# EAGLE board smarty07 (EAGLE 6.5.0)
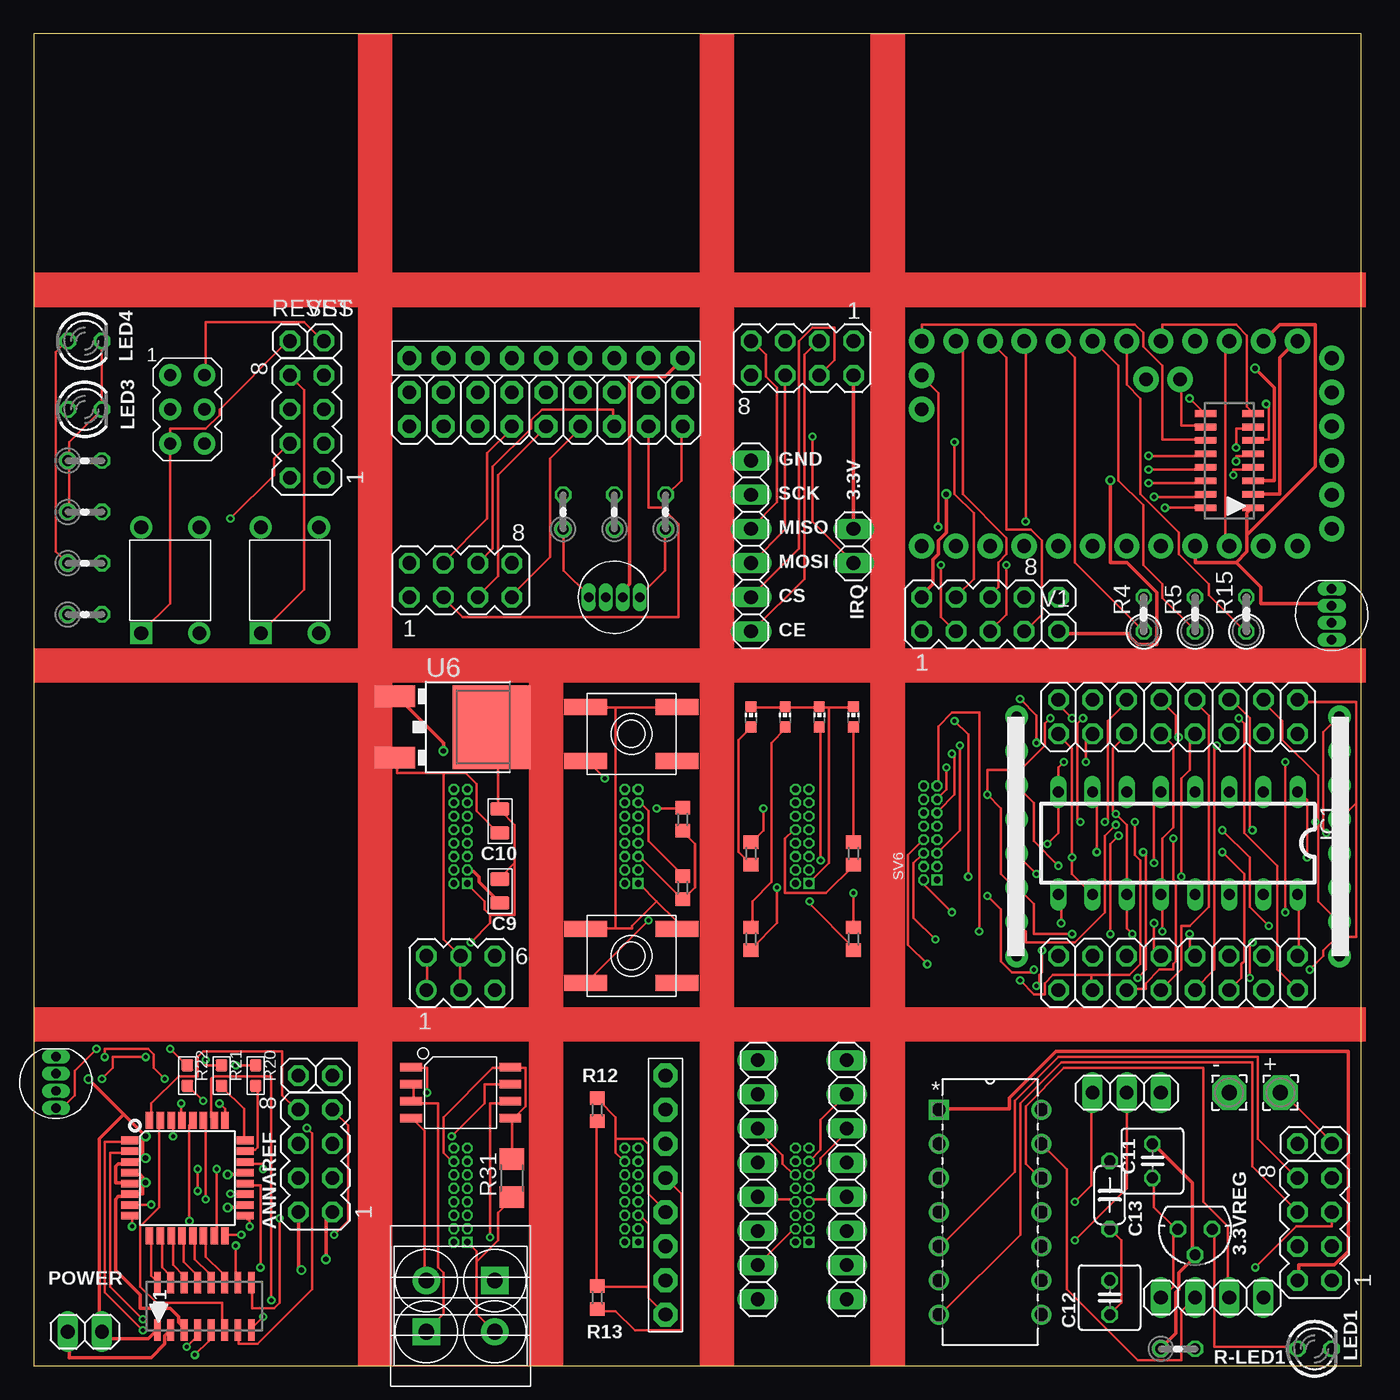
[diagram p2: board, top side]
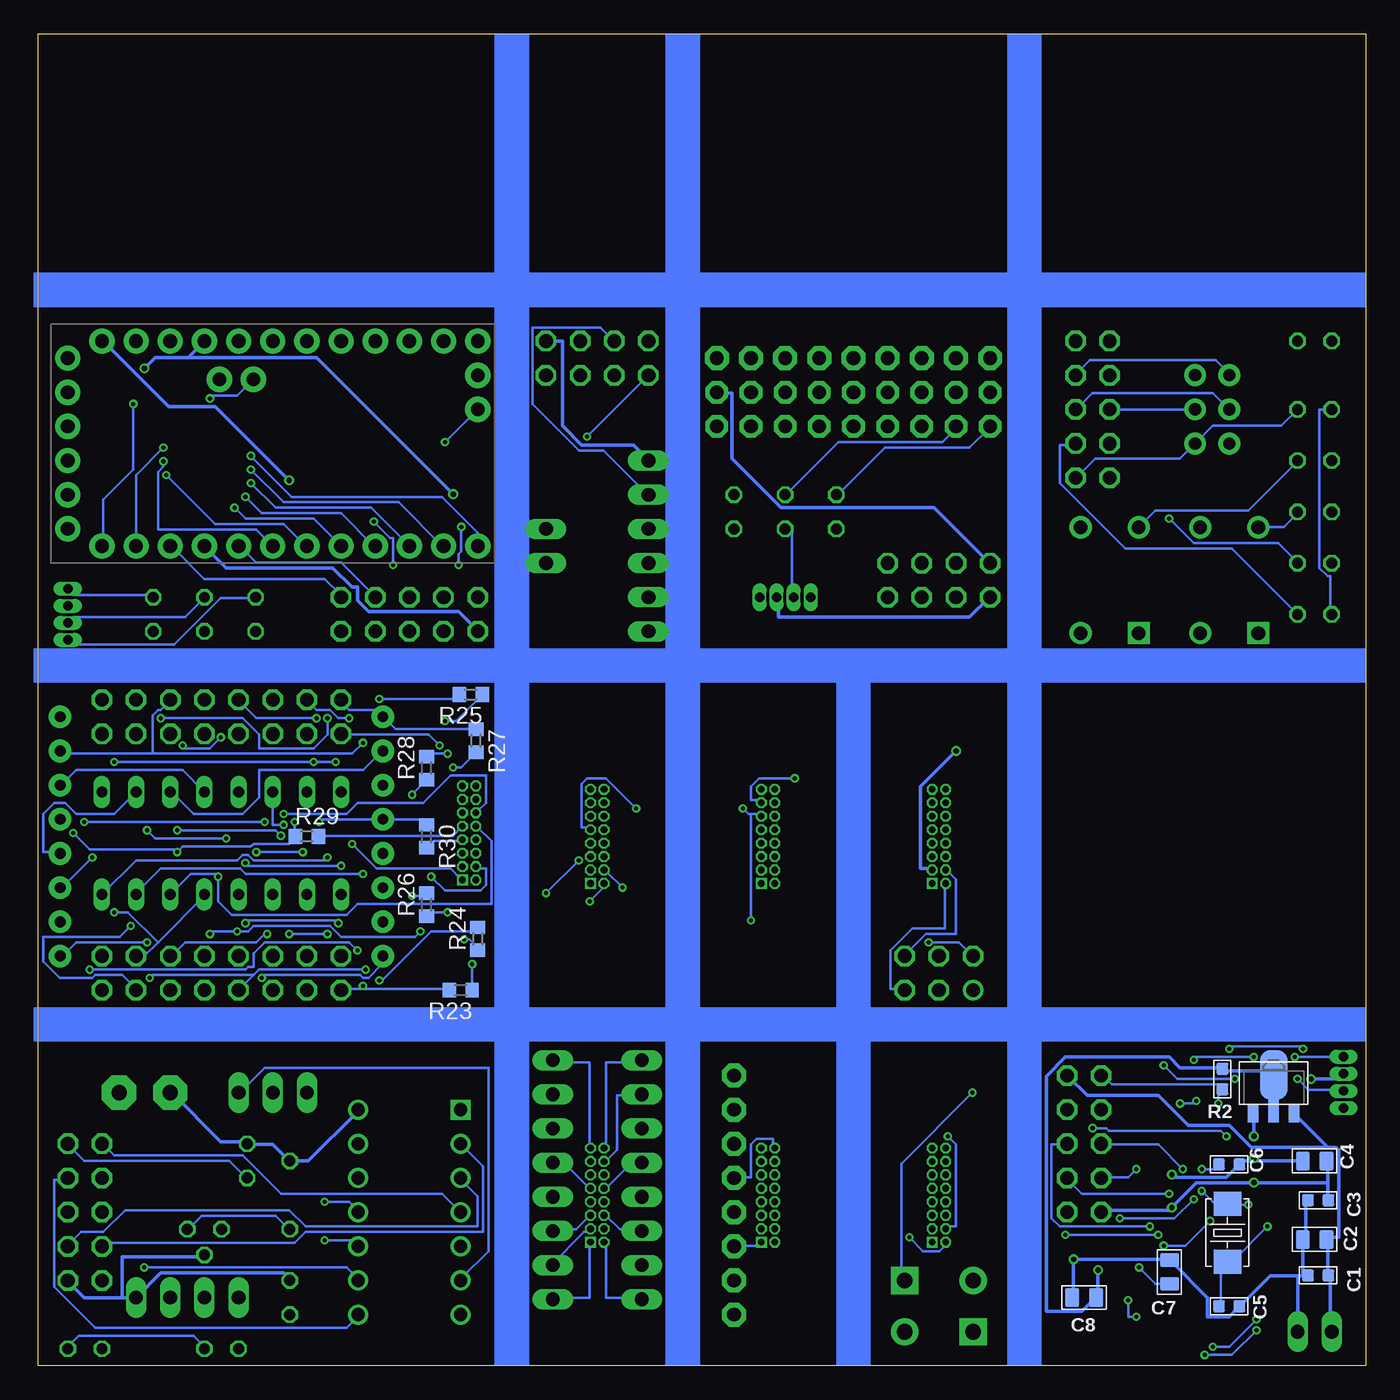
[diagram p3: board, bottom side, seen from below]

Size 98.73 x 99.05 mm. Coordinates in mm from the lower left corner, seen from the top.
Outline: 0,0 98.73,0 98.73,99.05 0,99.05 0,0
Copper layers (1*2*15*16): Top 0.035mm / dielectric 0.2mm / layer 2 0.0175mm / dielectric 1.1mm / layer 15 0.0175mm / dielectric 0.2mm / Bottom 0.035mm
Design rules "SeeedStudio_DRU_no_angle_20130527": minimum track width 6mil, minimum drill 12mil, track to track 6mil, track to pad 6mil, pad to pad 6mil, via to via 6mil, smd to smd 0mil, copper to edge 10mil, drill to drill 10mil, minimum pad ring 6mil, minimum via ring 6mil, stop-mask expansion 2mil, vias tented up to drill 25mil, thermal gap 10mil
Net classes: 0 default: width 0.203 mm, drill 0.203 mm, clearance 0.152 mm; 1 power: width 0.254 mm, drill 0.406 mm, clearance 0.152 mm; 2 thnet: width 0.203 mm, drill 0.203 mm, clearance 0.305 mm

## Footprints (pad centres in the part's own frame; a part is rotated, then mirrored left to right if it is on the bottom)
78LXX = drill 0.813 octagon: GND 0,1.905; IN 1.27,0; OUT -1.27,0
2,54/1,1 = drill 1.118 pad 2.54 octagon: 1 0,0
MA04-2 = drill 1.016 octagon: 1 -3.81,-1.27; 2 -3.81,1.27; 3 -1.27,-1.27; 4 -1.27,1.27; 5 1.27,-1.27; 6 1.27,1.27; 7 3.81,-1.27; 8 3.81,1.27
C0603 = smd 0.889 x 0.889: 1 -0.762,0; 2 0.762,0
C0805 = smd 1.016 x 1.397: 1 -0.889,0; 2 0.889,0
C025-050X050 = drill 0.813 octagon: 1 -1.27,0; 2 1.27,0
C050-024X044 = drill 0.813 octagon: 1 -2.54,0; 2 2.54,0
LED-RGB-THRU = drill 0.7 pad 1.016 long: 1 1.905,0; 2 0.635,0; 3 -0.635,0; 4 -1.905,0
DIL16 = drill 0.813 long: 1 -8.89,-3.81; 2 -6.35,-3.81; 3 -3.81,-3.81; 4 -1.27,-3.81; 5 1.27,-3.81; 6 3.81,-3.81; 7 6.35,-3.81; 8 8.89,-3.81; 9 8.89,3.81; 10 6.35,3.81; 11 3.81,3.81; 12 1.27,3.81; 13 -1.27,3.81; 14 -3.81,3.81; 15 -6.35,3.81; 16 -8.89,3.81
AVRISP = drill 0.9 pad 1.626: 1 -1.27,2.54; 2 1.27,2.54; 3 -1.27,0; 4 1.27,0; 5 -1.27,-2.54; 6 1.27,-2.54
SMRT-FEM-16 = smd 0.5 x 1.6: 1 -3.5,-1.765; 2 -3.5,1.765; 3 -2.5,-1.765; 4 -2.5,1.765; 5 -1.5,-1.765; 6 -1.5,1.765; 7 -0.5,-1.765; 8 -0.5,1.765; 9 0.5,-1.765; 10 0.5,1.765; 11 1.5,-1.765; 12 1.5,1.765; 13 2.5,-1.765; 14 2.5,1.765; 15 3.5,-1.765; 16 3.5,1.765
2P-5.0 = drill 1.168 pad 2.032 square: 1 -2.54,0 | drill 1.168 pad 2.032: 2 2.54,0
1X08-BIG = drill 1.016 pad 1.778 octagon: 1 -8.89,0; 2 -6.35,0; 3 -3.81,0; 4 -1.27,0; 5 1.27,0; 6 3.81,0; 7 6.35,0; 8 8.89,0
2X09-BIG = drill 1.016 pad 1.676 octagon: 1 -10.16,-1.27; 2 -10.16,1.27; 3 -7.62,-1.27; 4 -7.62,1.27; 5 -5.08,-1.27; 6 -5.08,1.27; 7 -2.54,-1.27; 8 -2.54,1.27; 9 0,-1.27; 10 0,1.27; 11 2.54,-1.27; 12 2.54,1.27; 13 5.08,-1.27; 14 5.08,1.27; 15 7.62,-1.27; 16 7.62,1.27; 17 10.16,-1.27; 18 10.16,1.27
1X09-BIG = drill 1.016 pad 1.778 octagon: 1 -10.16,0; 2 -7.62,0; 3 -5.08,0; 4 -2.54,0; 5 0,0; 6 2.54,0; 7 5.08,0; 8 7.62,0; 9 10.16,0
1X04 = drill 1.016 long: 1 -3.81,0; 2 -1.27,0; 3 1.27,0; 4 3.81,0
1X03 = drill 1.016 long: 1 -2.54,0; 2 0,0; 3 2.54,0
1X06 = drill 1.016 long: 1 -6.35,0; 2 -3.81,0; 3 -1.27,0; 4 1.27,0; 5 3.81,0; 6 6.35,0
1X02 = drill 1.016 long: 1 -1.27,0; 2 1.27,0
2X08 = drill 1.016 octagon: 1 -8.89,-1.27; 2 -8.89,1.27; 3 -6.35,-1.27; 4 -6.35,1.27; 5 -3.81,-1.27; 6 -3.81,1.27; 7 -1.27,-1.27; 8 -1.27,1.27; 9 1.27,-1.27; 10 1.27,1.27; 11 3.81,-1.27; 12 3.81,1.27; 13 6.35,-1.27; 14 6.35,1.27; 15 8.89,-1.27; 16 8.89,1.27
1X08 = drill 1.016 long: 1 -8.89,0; 2 -6.35,0; 3 -3.81,0; 4 -1.27,0; 5 1.27,0; 6 3.81,0; 7 6.35,0; 8 8.89,0
4P-6.0X6.0X5.0H = drill 1.016 pad 1.651 square: 1 -3.937,2.159 | drill 1.016 pad 1.651: 2 -3.937,-2.159; 3 3.937,-2.159; 4 3.937,2.159
LED3MM = drill 0.813 octagon: A -1.27,0; K 1.27,0
SEGMENT_BL-M12A881UR = drill 0.8 pad 1.676: 1 -8.89,-12; 2 -6.35,-12; 3 -3.81,-12; 4 -1.27,-12; 5 1.27,-12; 6 3.81,-12; 7 6.35,-12; 8 8.89,-12; 9 8.89,12; 10 6.35,12; 11 3.81,12; 12 1.27,12; 13 -1.27,12; 14 -3.81,12; 15 -6.35,12; 16 -8.89,12
CHIP-LED0603 = smd 0.8 x 0.8: A 0,-0.75; C 0,0.75
2P-SMD-5.0X3.2 = smd 1.778 x 2.032: 1 -2.159,0; 2 2.159,0
0204V = drill 0.813 octagon: 1 -1.27,0; 2 1.27,0
R0603 = smd 0.889 x 0.889: 1 -0.762,0; 2 0.762,0
0207/2V = drill 0.813 octagon: 1 -1.27,0; 2 1.27,0
R0603' = smd 1 x 1.1: 1 -0.85,0; 2 0.85,0
R1206 = smd 1.6 x 1.803: 1 -1.422,0; 2 1.422,0
1X01 = drill 1.016 octagon: 1 0,0
MA03-2 = drill 1.016: 1 -2.54,-1.27 | drill 1.016 octagon: 2 -2.54,1.27; 3 0,-1.27; 4 0,1.27; 5 2.54,-1.27; 6 2.54,1.27
MA08-2 = drill 0.5 pad 0.7 octagon: A3 3.5,-0.5; A4_SDA 3.5,0.5; A5_SCL 2.5,0.5; D0_RX 2.5,-0.5; D1_TX 1.5,-0.5; D3~ 0.5,-0.5; D4 -0.5,-0.5; D5~ -3.5,0.5; D6~ -2.5,0.5; D7 -1.5,0.5; D8 -0.5,0.5; D9~ 0.5,0.5; D10~ 1.5,0.5; VCC -1.5,-0.5; VSS -2.5,-0.5 | drill 0.5 pad 0.7 square: GND -3.5,-0.5
EVQ-Q2 = smd 3.2 x 1.2: A -3.4,-2; A' 3.4,-2; B -3.4,2; B' 3.4,2
SOT89 = smd 0.8 x 1.4: 1 -1.524,-1.905; 3 1.524,-1.905 | smd 0.8 x 1.9: 2 0,-1.651 | smd 2.032 x 3.65: 4 0,0.94
TQFP32 = smd 1.27 x 0.559: 1 -4.293,2.8; 2 -4.293,2; 3 -4.293,1.2; 4 -4.293,0.4; 5 -4.293,-0.4; 6 -4.293,-1.2; 7 -4.293,-2; 8 -4.293,-2.8; 17 4.293,-2.8; 18 4.293,-2; 19 4.293,-1.2; 20 4.293,-0.4; 21 4.293,0.4; 22 4.293,1.2; 23 4.293,2; 24 4.293,2.8 | smd 0.559 x 1.27: 9 -2.8,-4.293; 10 -2,-4.293; 11 -1.2,-4.293; 12 -0.4,-4.293; 13 0.4,-4.293; 14 1.2,-4.293; 15 2,-4.293; 16 2.8,-4.293; 25 2.8,4.293; 26 2,4.293; 27 1.2,4.293; 28 0.4,4.293; 29 -0.4,4.293; 30 -1.2,4.293; 31 -2,4.293; 32 -2.8,4.293
DIP254P762X533-14 = drill 0.991 square: 1 -7.62,15.24 | drill 0.991: 2 -7.62,12.7; 3 -7.62,10.16; 4 -7.62,7.62; 5 -7.62,5.08; 6 -7.62,2.54; 7 -7.62,0; 8 0,0; 9 0,2.54; 10 0,5.08; 11 0,7.62; 12 0,10.16; 13 0,12.7; 14 0,15.24
SOIC8 = smd 0.635 x 1.6: 1 -1.905,-3.683; 2 -0.635,-3.683; 3 0.635,-3.683; 4 1.905,-3.683; 5 1.905,3.683; 6 0.635,3.683; 7 -0.635,3.683; 8 -1.905,3.683
DPAK-3 = smd 1.6 x 3: 1 -2.286,-7.18; 3 2.286,-7.18 | smd 6.2 x 5.8: 4 0,0
ARDUINO_PRO_MINI = drill 1.016 pad 1.88: 1 -7.62,12.7; 2 -7.62,10.16; 3 -7.62,7.62; 4 -7.62,5.08; 5 -7.62,2.54; 6 -7.62,0; 7 -7.62,-2.54; 8 -7.62,-5.08; 9 -7.62,-7.62; 10 -7.62,-10.16; 11 -7.62,-12.7; 12 -7.62,-15.24; 13 7.62,-15.24; 14 7.62,-12.7; 15 7.62,-10.16; 16 7.62,-7.62; 17 7.62,-5.08; 18 7.62,-2.54; 19 7.62,0; 20 7.62,2.54; 21 7.62,5.08; 22 7.62,7.62; 23 7.62,10.16; 24 7.62,12.7; A4 4.763,1.429; A5 4.763,3.969; A6 5.08,-15.24; A7 2.54,-15.24; BLK 6.35,15.24; GND 3.81,15.24; GRN -6.35,15.24; RXI -1.27,15.24; TXO -3.81,15.24; VCC 1.27,15.24

## Placement (x,y rotation side)
3.3VREG  [78LXX]  86.36,10.16 180 top
+  [2,54/1,1]  92.71,20.32 0 top
-  [2,54/1,1]  88.9,20.32 0 top
ANNAREF  [MA04-2]  20.95,15.24 90 top
ANNAREF2  [MA04-2]  69.85,55.88 0 top
ANNAREF3  [MA04-2]  95.25,10.16 90 top
ANNAREF4  [MA04-2]  57.15,74.93 180 top
ANNAREF_  [MA04-2]  31.75,58.42 0 top
C1  [C0603]  3.56,6.73 180 bottom
C2  [C0805]  3.81,9.4 180 bottom
C3  [C0603]  3.56,12.32 180 bottom
C4  [C0805]  3.81,15.24 180 bottom
C5  [C0603]  10.16,4.45 180 bottom
C6  [C0603]  10.16,14.99 180 bottom
C7  0.1uF  [C0805]  14.61,6.99 90 bottom
C8  [C0805]  20.95,5.08 180 bottom
C9  [C0805]  34.67,35.31 90 top
C10  [C0805]  34.67,40.51 90 top
C11  10uF  [C025-050X050]  83.19,15.24 90 top
C12  10uF  [C025-050X050]  80.01,5.08 90 top
C13  100nF  [C050-024X044]  80.01,12.7 270 top
D1  LED-RGB-CC-THRUCLEAR  [LED-RGB-THRU]  43.18,57.15 0 top
D2  LED-RGB-CC-THRUCLEAR  [LED-RGB-THRU]  96.52,55.88 90 top
D3  LED-RGB-CC-THRUCLEAR  [LED-RGB-THRU]  1.65,21.08 90 top
IC1  74LS595N  [DIL16]  85.09,38.86 180 top
ISP1  AVRISP-6  [AVRISP]  11.43,71.12 0 top
J1  CON-SMD-2X8-1.0MM  [SMRT-FEM-16]  12.7,4.45 180 top
J2  SCREW-TERMINAL-2P-3470110P1  [2P-5.0]  31.75,2.54 0 top
J3  SCREW-TERMINAL-2P-3470110P1  [2P-5.0]  31.75,6.35 180 top
JP1  [1X08-BIG]  46.99,12.7 90 top
JP2  [2X09-BIG]  38.1,71.12 0 top
JP3  [1X09-BIG]  38.1,74.93 0 top
JP4  [1X04]  87.63,5.08 0 top
JP5  [1X03]  81.28,20.32 0 top
JP6  [1X06]  53.34,60.96 270 top
JP7  [1X02]  60.96,60.96 90 top
JP8  [2X08]  85.09,29.21 180 top
JP9  [2X08]  85.09,48.26 0 top
JP10  [1X08]  53.85,13.84 270 top
JP11  [1X08]  60.45,13.84 270 top
K2  BUTTON-4P-3110040P1  [4P-6.0X6.0X5.0H]  10.16,58.42 90 top
K3  BUTTON-4P-3110040P1  [4P-6.0X6.0X5.0H]  19.05,58.42 90 top
LED1  [LED3MM]  95.25,1.27 0 top
LED3  [LED3MM]  3.81,71.12 0 top
LED4  [LED3MM]  3.81,76.2 0 top
LED8  [SEGMENT_BL-M12A881UR]  85.09,39.37 90 top
LED9  [CHIP-LED0603]  53.34,48.26 0 top
LED10  [CHIP-LED0603]  58.42,48.26 0 top
LED11  [CHIP-LED0603]  55.88,48.26 0 top
LED12  [CHIP-LED0603]  60.96,48.26 0 top
NRF  [MA04-2]  20.32,69.85 90 top
POWER  [1X02]  3.81,2.54 0 top
Q1  CRYSTAL  [2P-SMD-5.0X3.2]  10.29,9.91 90 bottom
R1  [0204V]  39.37,63.5 90 top
R2  10k  [R0603]  10.67,21.34 90 bottom
R3  [0204V]  43.18,63.5 90 top
R4  [0207/2V]  82.55,55.88 90 top
R5  [0207/2V]  86.36,55.88 90 top
R6  [0204V]  3.81,55.88 0 top
R7  [0204V]  3.81,59.69 0 top
R8  [0204V]  3.81,63.5 0 top
R9  [0204V]  3.81,67.31 0 top
R10  [R0603']  48.26,35.56 270 top
R11  [R0603']  48.26,40.64 270 top
R12  [R0603']  41.91,19.05 270 top
R13  [R0603']  41.91,5.08 90 top
R14  [0204V]  46.99,63.5 90 top
R15  [0207/2V]  90.17,55.88 90 top
R16  [R0603']  53.34,38.1 90 top
R17  [R0603']  60.96,31.75 270 top
R18  [R0603']  53.34,31.75 270 top
R19  [R0603']  60.96,38.1 270 top
R20  1k  [R0603]  16.51,21.59 270 top
R21  1k  [R0603]  13.97,21.59 270 top
R22  1k  [R0603]  11.43,21.59 270 top
R23  [R0603']  67.31,27.94 180 bottom
R24  [R0603']  66.04,31.75 90 bottom
R25  [R0603']  66.55,49.91 180 bottom
R26  [R0603']  69.85,34.29 90 bottom
R27  [R0603']  66.17,46.48 270 bottom
R28  [R0603']  69.85,44.45 90 bottom
R29  [R0603']  78.74,39.37 0 bottom
R30  [R0603']  69.85,39.37 270 bottom
R31  [R1206]  35.56,13.97 90 top
R-LED1  120  [0204V]  85.09,1.27 0 top
RESET  [1X01]  19.05,76.2 0 top
RESET1  [1X01]  93.98,16.51 0 top
RST  [1X01]  19.68,21.59 0 top
RST1  [1X01]  76.2,57.15 0 top
SERVOS  [MA03-2]  31.75,29.21 0 top
SV1  [MA08-2]  31.75,39.37 90 top
SV2  [MA08-2]  31.75,12.7 90 top
SV3  [MA08-2]  44.45,39.37 90 top
SV4  [MA08-2]  44.45,12.7 90 top
SV5  CON-SMD-2X8-1.0MM  [SMRT-FEM-16]  88.9,67.31 270 top
SV6  [MA08-2]  66.67,39.62 90 top
SV7  [MA08-2]  57.15,12.7 90 top
SV8  [MA08-2]  57.15,39.37 90 top
SW1  SPST_TACT-EVQQ2  [EVQ-Q2]  44.45,46.99 0 top
SW2  SPST_TACT-EVQQ2  [EVQ-Q2]  44.45,30.48 0 top
U1  1117-3.3  [SOT89]  6.86,20.7 0 bottom
U2  ATMEGA328P  [TQFP32]  11.43,13.97 0 top
U3  ATTINY84-20PU  [DIP254P762X533-14]  74.93,3.81 0 top
U5  L9110  [SOIC8]  31.75,20.32 270 top
U6  MC7805DT  [DPAK-3]  34.04,47.5 270 top
U$1  ARDUINO_PRO_MINI  [ARDUINO_PRO_MINI]  81.28,68.58 90 bottom
V  [1X01]  22.23,21.59 0 top
V1  [1X01]  76.2,54.61 0 top
VSS  [1X01]  21.59,76.2 0 top
VSS1  [1X01]  96.52,16.51 0 top

## Tracks (layer width: path | path; a pad name or v marks a point on that pad's centre or on a via)
3.3V  (via drill 0.41)
  Top 0.254: 8.13,13.61 8.13,14.02 7.92,14.22 7.32,14.22 U2.4 | 8.13,13.61 8.13,12.8 7.32,12.8 U2.6 7.11,12.6 6.3,12.6 6.1,12.39 6.1,7.11 7.92,5.28 7.92,4.27 10.16,4.27 10.77,3.66 10.77,3.25 11.18,2.85 J1.12 | v14.43,11.79 15.65,11.79 U2.18 | v19.91,7.11 19.71,7.32 19.71,11.38 ANNAREF.2 | v8.33,13.61 8.13,13.61
  Bottom 0.254: U1.2 6.91,19.1 6.91,21.54 U1.4 6.91,21.74 7.11,21.95 10.57,21.95 R2.2 10.77,22.15 13.82,22.15 14.63,22.96 22.35,22.96 23.77,21.54 23.77,4.06 21.13,4.06 20.12,5.08 C8.1 19.91,5.08 v19.91,7.11 | 2.85,13.61 2.85,15.24 C4.1 | 2.85,13.61 2.85,12.39 C3.1 | ANNAREF.2 19.51,11.58 14.63,11.58 v14.43,11.79 12.6,13.61 v8.33,13.61 2.85,13.61
84_3.3V
  Top 0.254: U3.1 67.46,19.1 72.54,19.1 72.54,19.91 76,23.37 97.74,23.37 97.74,8.53 96.72,7.52 94.08,7.52 94.08,6.5 ANNAREF3.2
84_3V3
  Top 0.203: C12.1 80.87,4.67 80.87,9.35 80.06,10.16 C13.2 | LED1.A 93.88,1.42 87.78,1.42 87.78,10.16 3.3VREG.OUT
  Bottom 0.203: C13.2 80.06,10.16 81.08,11.18 86.56,11.18 87.58,10.16 3.3VREG.OUT
84_CE
  Bottom 0.203: U3.3 67.26,13.82 66.04,12.6 66.04,10.36 78.84,10.36 80.06,11.58 92.25,11.58 93.88,9.96 95.5,9.96 96.52,8.94 ANNAREF3.3
84_CS
  Bottom 0.203: U3.2 65.63,14.83 65.63,9.96 78.84,9.96 79.65,9.14 93.67,9.14 93.88,8.94 ANNAREF3.4
84_GND
  Top 0.254: R-LED1.1 83.92,1.42 84.94,2.44 84.94,5.49 85.14,5.69 85.14,6.91 86.36,8.13 3.3VREG.GND 86.36,8.33 86.16,8.53 86.16,13.61 83.31,16.46 C11.2
  Bottom 0.254: C12.2 80.06,6.5 80.47,6.91 89.61,6.91 JP4.4 92.46,5.08 | 92.46,5.08 95.3,5.08 96.52,6.3 ANNAREF3.1 | U3.14 74.98,18.9 78.64,15.24 C13.1 80.06,15.24 81.28,16.46 83.11,16.46 C11.2 83.31,16.66 85.14,16.66 88.8,20.32 -.1 | 92.46,5.08 92.46,8.13 86.36,8.13 3.3VREG.GND
84_GPIO1  (via drill 0.3)
  Top 0.203: v77.42,12.19 78.64,13.41 78.64,20.32 JP5.1
  Bottom 0.203: v77.42,12.19 75.59,12.19 74.98,11.58 U3.11
84_GPIO2  (via drill 0.3)
  Top 0.203: v77.42,9.35 81.28,13.21 JP5.2
  Bottom 0.203: U3.10 75.39,9.35 v77.42,9.35
84_GPIO3
  Bottom 0.203: U3.6 67.26,6.5 65.23,8.53 65.23,22.15 81.89,22.15 83.72,20.32 JP5.3
84_IRQ
  Top 0.203: U3.5 67.46,8.94 72.95,14.43 72.95,19.71 76.2,22.96 91.03,22.96 91.03,16.87 93.88,14.02 ANNAREF3.8
84_MISO
  Bottom 0.203: U3.8 74.98,3.66 75.79,2.85 94.49,2.85 97.54,5.89 97.54,13.82 96.52,13.82 ANNAREF3.7
84_MOSI
  Top 0.203: U3.7 67.46,3.86 73.36,9.75 73.36,19.51 76.4,22.55 90.63,22.55 90.63,14.83 93.88,11.58 ANNAREF3.6
84_RL1
  Top 0.203: U3.13 76.81,14.63 76.81,5.69 82.09,0.41 85.34,0.41 85.34,4.06 JP4.2
84_RL2
  Top 0.203: U3.12 74.78,14.02 73.76,15.04 73.76,19.3 76.61,22.15 86.97,22.15 86.97,12.19 88.8,10.36 88.8,5.08 JP4.3
84_RST
  Bottom 0.203: U3.4 68.68,12.8 80.67,12.8 83.52,15.65 93.07,15.65 93.88,16.46 RESET1.1
84_SCK  (via drill 0.3)
  Top 0.203: v90.83,7.32 93.88,10.36 96.52,10.36 ANNAREF3.5
  Bottom 0.203: v90.83,7.32 75.79,7.32 74.98,6.5 U3.9
84_VSS
  Top 0.203: 84.73,10.36 83.31,11.79 83.31,13.82 C11.1 | 84.73,10.36 84.94,10.16 3.3VREG.IN 84.73,10.36 | 84.73,10.36 84.73,5.89 83.92,5.08 JP4.1 | VSS1.1 96.52,16.66 92.86,20.32 +.1
  Bottom 0.203: C11.1 83.31,14.02 84.53,15.24 95.3,15.24 96.52,16.46 VSS1.1
AD0
  Top 0.203: R20.2 16.66,20.73 16.66,16.26 16.46,16.05 15.85,16.05 U2.23
AD1
  Top 0.203: R21.2 14.02,20.73 15.65,19.1 15.65,16.87 U2.24
AD2  (via drill 0.3)
  Top 0.203: v12.6,19.71 11.58,20.73 R22.2 | v13.82,19.51 14.22,19.1 14.22,18.29 U2.25
  Bottom 0.203: v12.6,19.71 12.8,19.51 v13.82,19.51
AD3  (via drill 0.3)
  Top 0.203: v17.68,4.88 17.68,21.54 13.41,21.54 13.21,21.34 13.21,18.49 13.41,18.29 U2.26 | v17.07,3.66 16.26,2.85 J1.2
  Bottom 0.203: v17.68,4.88 17.68,3.66 v17.07,3.66
AM_3.3V  (via drill 0.41)
  Top 0.254: v90.83,74.17 92.25,72.75 92.25,65.84 90.83,65.84 SV5.12 | v67.87,64.82 67.87,61.98 67.26,61.37 67.26,60.35 66.85,59.94 66.85,58.12 66.04,57.3 ANNAREF2.2
  Bottom 0.254: v90.83,74.17 90.02,74.98 87.58,74.98 | U$1.21 87.58,74.98 | v67.87,64.82 78.03,74.98 87.58,74.98
AM_A3
  Top 0.203: SV5.2 90.63,70.92 90.22,71.32 90.22,76.61 89.41,77.42 83.92,77.42 83.92,76.2 U$1.20
AM_CE  (via drill 0.3)
  Top 0.203: v67.46,59.54 67.46,55.68 68.48,54.66 ANNAREF2.3 | v67.26,62.38 67.26,72.34 66.04,73.56 U$1.A6
  Bottom 0.203: v67.46,59.54 67.46,60.35 67.26,60.55 v67.26,62.38
AM_CS  (via drill 0.3)
  Top 0.203: v68.48,68.68 68.48,64.82 69.9,63.4 69.9,58.52 68.68,57.3 ANNAREF2.4
  Bottom 0.203: U$1.A7 v68.48,68.68
AM_GND
  Top 0.254: 90.22,61.77 90.22,60.55 89.41,59.74 | 90.22,61.77 90.22,63.4 90.63,63.8 SV5.16 | 89.41,59.74 86.36,59.74 U$1.4 | 89.41,59.74 91.24,57.91 91.24,56.69 96.52,56.69 D2.2 | U$1.23 92.66,77.42 95.3,77.42 95.3,66.85 90.22,61.77
  Bottom 0.254: U$1.4 84.73,59.33 76.81,59.33 75.39,57.91 74.98,57.91 74.98,56.9 74.17,56.08 67.46,56.08 66.04,54.66 ANNAREF2.1
AM_IRQ
  Bottom 0.203: ANNAREF2.8 73.76,57.3 76.2,59.74 82.5,59.74 83.72,60.96 U$1.5
AM_MISO
  Top 0.203: U$1.15 72.34,74.98 72.34,62.18 74.17,62.18 74.98,61.37 74.98,55.88 73.76,54.66 ANNAREF2.7
AM_MOSI
  Top 0.203: ANNAREF2.6 71.12,57.3 71.73,57.91 71.73,59.74 72.34,60.35 72.34,61.57 69.09,64.82 69.09,75.79 68.68,76.2 U$1.14
AM_RST
  Top 0.203: U$1.22 88.8,76.2 88.59,76 88.59,61.16 88.8,60.96 U$1.3
  Bottom 0.203: RST1.1 76.2,57.3 77.42,58.52 86.36,58.52 88.8,60.96 U$1.3
AM_SCK  (via drill 0.3)
  Top 0.203: v72.34,59.54 72.34,55.88 71.12,54.66 ANNAREF2.5 | v73.76,62.79 73.76,76.2 U$1.16
  Bottom 0.203: v72.34,59.54 72.34,61.57 72.54,61.57 v73.76,62.79
AM_VSS  (via drill 0.41)
  Top 0.254: SV5.14 90.83,64.82 92.66,64.82 92.66,74.98 93.88,76.2 U$1.24 | v80.06,65.84 80.06,59.74 81.28,59.74 83.52,57.51 83.52,53.65 82.09,53.65 81.48,54.25 81.48,54.46 76.2,54.46 V1.1
  Bottom 0.254: v80.06,65.84 85.55,71.32 89,71.32 93.88,76.2 U$1.24
ARSH_3.3V
  Top 0.254: ANNAREF4.2 JP7.2
ARSH_CE
  Top 0.203: JP6.6 53.44,54.66 57.3,58.52 57.3,75.18 58.32,76.2 ANNAREF4.3
ARSH_CS
  Top 0.203: ANNAREF4.4 59.54,74.78 59.54,77.22 57.91,77.22 56.9,76.2 56.9,60.76 53.44,57.3 JP6.5
ARSH_GND
  Bottom 0.254: ANNAREF4.1 59.74,76.2 59.74,69.9 58.32,68.48 54.46,68.48 53.44,67.46 JP6.1
ARSH_IRQ  (via drill 0.3)
  Top 0.203: v57.91,69.09 57.91,62.79 60.96,59.74 JP7.1
  Bottom 0.203: ANNAREF4.8 v57.91,69.09
ARSH_MISO
  Top 0.203: JP6.3 53.44,62.38 55.27,64.21 55.27,72.75 54.46,73.56 54.46,75.18 53.44,76.2 ANNAREF4.7
ARSH_MOSI
  Top 0.203: ANNAREF4.6 55.88,62.18 53.44,59.74 JP6.4
ARSH_SCK
  Bottom 0.203: ANNAREF4.5 56.9,77.22 61.98,77.22 61.98,71.53 58.52,68.07 56.69,68.07 53.44,64.82 JP6.2
CE  (via drill 0.3)
  Top 0.203: v14.63,12.8 15.65,12.8 U2.19
  Bottom 0.203: v14.63,12.8 21.13,12.8 22.15,13.82 ANNAREF.3
CE2
  Bottom 0.203: R6.2 9.96,60.76 17.88,60.76 22.76,65.63 22.76,68.48 21.74,68.48 NRF.3
COL1  (via drill 0.3)
  Top 0.203: v74.57,36.58 73.15,38 LED8.13
  Bottom 0.203: v74.57,36.58 83.31,36.58 83.72,36.98 89.61,36.98 91.44,35.15 IC1.15
COL2  (via drill 0.3)
  Top 0.203: v94.69,37.8 94.69,42.06 94.08,42.67 IC1.1
  Bottom 0.203: v94.69,37.8 96.93,35.56 LED8.3
COL3
  Bottom 0.203: IC1.2 93.07,41.05 95.91,41.05 96.72,41.86 97.54,41.86 98.35,41.05 98.35,38.2 97.13,38.2 LED8.4
COL4
  Bottom 0.203: IC1.3 88.8,42.67 87.17,41.05 83.52,41.05 82.3,42.27 82.3,44.3 74.57,44.3 73.15,45.72 LED8.10
COL5
  Bottom 0.203: IC1.4 87.99,44.3 95.91,44.3 96.93,43.28 LED8.6
COL6  (via drill 0.3)
  Top 0.203: v83.31,37.39 83.31,42.27 83.72,42.67 IC1.5 | v76.2,37.19 74.37,39.01 74.37,41.86 73.15,43.08 LED8.11
  Bottom 0.203: v83.31,37.39 83.11,37.19 v76.2,37.19
COL7  (via drill 0.3)
  Top 0.203: v80.47,40.23 79.65,39.42 79.65,33.73 77.42,31.5 73.76,31.5 73.76,32.31 73.15,32.92 LED8.15
  Bottom 0.203: IC1.6 81.28,40.23 v80.47,40.23
COL8  (via drill 0.3)
  Top 0.203: v79.05,38.2 79.05,42.47 78.84,42.67 IC1.7 | v82.5,38.2 82.7,38 82.7,29.46 v82.09,28.85
  Bottom 0.203: v82.5,38.2 v79.05,38.2 | v82.09,28.85 81.89,29.06 74.78,29.06 74.57,28.85 74.17,28.85 73.15,29.87 73.15,30.48 LED8.16
CS  (via drill 0.3)
  Top 0.203: v17.07,14.63 17.07,15.04 15.85,15.04 U2.22
  Bottom 0.203: v17.07,14.63 17.68,14.02 19.51,14.02 ANNAREF.4
CSN2  (via drill 0.3)
  Top 0.203: v14.63,62.99 17.88,66.24 17.88,67.46 18.9,68.48 NRF.4
  Bottom 0.203: v14.63,62.99 12.8,61.16 6.5,61.16 5.08,59.74 R7.2
DV_3.3V
  Bottom 0.254: ANNAREF_.2 28.04,59.74 32.11,63.8 43.48,63.8 47.14,67.46 47.14,72.34 48.16,72.34 JP2.18
DV_CE
  Top 0.203: JP2.15 45.72,63.8 46.74,63.8 47.95,62.59 47.95,55.68 31.9,55.68 30.48,57.1 ANNAREF_.3
DV_CS
  Top 0.203: ANNAREF_.4 30.48,59.74 33.73,62.99 33.73,67.87 35.56,69.7 JP2.7
DV_GND
  Top 0.254: JP3.9 48.16,74.78 46.94,73.56 44.3,73.56 44.3,58.12 43.89,57.71 43.89,57.3 D1.2
  Bottom 0.254: D1.2 43.69,57.1 43.69,55.68 29.46,55.68 28.04,57.1 ANNAREF_.1
DV_MISO
  Top 0.203: ANNAREF_.7 35.56,57.3 38.41,60.15 38.41,67.46 40.64,69.7 JP2.11
DV_MOSI
  Top 0.203: ANNAREF_.6 33.12,59.74 34.14,60.76 34.14,66.85 36.98,69.7 36.98,70.31 37.8,71.12 43.08,71.12 43.08,69.9 JP2.13
DV_SCK
  Top 0.203: ANNAREF_.5 33.12,57.3 34.54,58.73 34.54,66.24 38,69.7 JP2.9
GND  (via drill 0.41)
  Top 0.254: v14.43,14.22 15.65,14.22 U2.21 | U2.5 7.11,13.61 6.1,13.61 6.1,14.83 6.3,15.04 7.11,15.04 U2.3 7.32,15.24 7.72,15.24 8.13,15.65 | 8.13,15.65 8.13,16.87 v8.33,17.07 6.71,18.69 | 6.71,18.69 v4.06,21.34 | 8.13,15.65 v8.33,15.44 | J1.16 9.14,2.64 8.53,2.03 5.08,2.03 POWER.2 5.08,2.64 4.88,2.85 4.88,16.87 6.71,18.69 | v21.74,7.92 21.74,10.97 22.15,11.38 ANNAREF.1
  Bottom 0.254: C4.2 8.33,15.24 | 8.33,15.24 9.14,15.24 C6.1 10.36,14.02 14.22,14.02 v14.43,14.22 | v8.33,17.07 8.33,18.69 U1.1 | D3.2 2.03,21.34 v4.06,21.34 | v8.33,15.44 8.33,15.24 | C3.2 4.47,12.19 4.47,9.55 4.67,9.55 C2.2 4.67,9.35 4.67,6.91 4.47,6.91 C1.2 4.47,6.71 5.08,6.71 | 5.08,6.71 7.11,6.71 9.35,4.47 C5.1 9.55,4.27 10.16,3.66 11.79,3.66 11.79,5.08 14.43,7.72 C7.2 14.63,7.92 v21.74,7.92 21.74,5.08 C8.2 | 5.08,6.71 POWER.2
IA  (via drill 0.3)
  Top 0.203: v33.93,9.55 33.93,19.51 35.36,19.51 U5.6
  Bottom 0.203: v33.93,9.55 32.92,8.53 31.7,8.53 31.09,9.14 SV2.D5~
IB  (via drill 0.3)
  Top 0.203: v31.09,17.07 33.53,19.51 33.53,20.93 35.36,20.93 U5.7
  Bottom 0.203: v31.09,17.07 30.48,16.46 30.48,10.36 31.09,10.36 SV2.D6~
IRQ
  Top 0.203: U2.32 8.74,18.29 8.74,19.51 10.77,21.54 12.19,21.54 12.19,22.96 12.6,23.37 18.49,23.37 18.49,20.12 19.51,19.1 ANNAREF.8
IRQ2
  Top 0.203: K3.1 20.12,57.71 20.12,72.54 19.1,73.56 NRF.8
ISP_GND
  Top 0.203: R8.1 2.64,63.6 2.64,67.26 R9.1 2.64,67.46 2.64,68.68 LED3.K LED4.K
  Bottom 0.203: NRF.1 21.54,66.04 20.12,67.46 13.82,67.46 ISP1.6 11.38,69.9 6.3,69.9 LED3.K
ISP_MISO
  Bottom 0.203: NRF.7 21.54,73.76 20.52,74.78 11.18,74.78 10.16,73.76 ISP1.1
ISP_MOSI
  Bottom 0.203: ISP1.4 NRF.6
ISP_RST
  Top 0.203: RESET.1 18.9,76.2 13.82,71.12 13.82,70.71 12.8,69.7 10.16,69.7 ISP1.5 10.16,56.69 8.13,54.66 K2.1
ISP_SCK
  Bottom 0.203: ISP1.3 11.38,72.34 20.32,72.34 21.54,71.12 NRF.5
ISP_VCC
  Top 0.203: VSS.1 21.54,76.2 20.12,77.62 12.8,77.62 12.8,73.76 ISP1.2
LD1  (via drill 0.3)
  Top 0.203: v54.25,41.45 54.25,39.83 53.44,39.01 R16.2
  Bottom 0.203: v54.25,41.45 56.49,43.69 57.91,43.69 58.32,43.28 58.32,40.03 57.71,40.03 SV8.D3~
LD2  (via drill 0.3)
  Top 0.203: v57.71,34.54 57.71,34.34 60.96,31.09 R17.2
  Bottom 0.203: v57.71,34.54 56.49,35.76 SV8.D5~
LD3  (via drill 0.3)
  Top 0.203: v55.27,35.56 55.27,32.92 53.44,31.09 R18.2
  Bottom 0.203: v55.27,35.56 56.49,36.78 SV8.D6~
LD4
  Top 0.203: R19.2 60.96,37.19 58.93,35.15 55.88,35.15 55.88,39.22 56.49,39.83 SV8.D9~
MDC_GND
  Top 0.203: 32.92,7.72 32.92,3.86 34.14,2.64 J2.2 | 32.92,7.72 32.92,8.53 32.31,9.14 SV2.GND | 32.92,7.72 34.54,9.35 34.54,11.38 35.56,12.39 R31.1
MDC_SENSE
  Top 0.203: R31.2 35.56,18.29 | 35.56,18.29 36.58,19.3 36.58,22.15 35.56,22.15 U5.8 35.36,22.15 34.14,22.15 30.48,18.49 30.48,15.85 31.09,15.24 SV2.A5_SCL | 35.56,18.29 U5.5
MDC_VCC
  Top 0.203: U5.2 28.25,20.93 28.25,19.71 U5.3 28.25,19.51 30.07,19.51 30.07,7.32 30.48,6.91 30.48,3.86 29.26,2.64 J2.1
MISO  (via drill 0.3)
  Top 0.203: v15.44,9.75 14.43,9.75 U2.16 | v22.35,9.75 23.37,10.77 23.37,17.88 22.35,18.9 ANNAREF.7
  Bottom 0.203: v22.35,9.75 v15.44,9.75
MK_VCC
  Top 0.203: SV3.VCC 45.11,37.8 48.16,34.75 R10.2 48.36,34.75 49.17,35.56 49.17,38.81 48.36,39.62 R11.2
MOSI  (via drill 0.3)
  Top 0.203: v13.61,14.63 13.61,9.75 U2.15
  Bottom 0.203: v13.61,14.63 15.44,16.46 19.51,16.46 ANNAREF.6
MX_CLOCK  (via drill 0.3)
  Top 0.203: JP9.5 81.28,46.94 80.26,45.92 80.26,41.25 v80.47,41.05 81.28,40.23 IC1.11 81.28,32.51 v81.69,32.11
  Bottom 0.203: v80.47,41.05 75.79,41.05 74.98,41.86 70.1,41.86 68.07,43.89 65.43,43.89 65.43,41.86 66.04,41.25 SV6.D10~ | v81.69,32.11 81.89,32.11 82.5,31.5 87.78,31.5 88.8,30.48 JP8.5
MX_DATA  (via drill 0.3)
  Top 0.203: v85.34,36.37 85.34,43.69 85.95,44.3 85.95,46.53 86.36,46.94 JP9.9
  Bottom 0.203: IC1.14 87.38,36.58 85.34,36.58 v85.34,36.37 85.34,34.54 84.33,33.53 75.79,33.53 74.98,34.34 65.02,34.34 65.02,39.01 66.04,40.03 SV6.D9~
MX_DATAOUT  (via drill 0.3)
  Top 0.203: v76.4,32.92 76.4,34.75 76.2,34.95 IC1.9 | v83.31,32.92 83.31,30.89 83.72,30.48 JP8.9
  Bottom 0.203: v76.4,32.92 76.61,33.12 83.11,33.12 v83.31,32.92
MX_GND  (via drill 0.3)
  Top 0.203: v75.39,38.81 76.2,39.62 IC1.8 76.2,44.5 v76.61,44.91 | v78.23,44.91 78.23,46.53 78.64,46.94 JP9.3 | v93.07,44.91 v93.07,33.73
  Bottom 0.203: 89.81,31.5 90.83,30.48 JP8.3 | 89.81,31.5 86.36,34.95 IC1.13 | v75.39,38.81 73.56,36.98 68.07,36.98 67.26,36.17 SV6.GND | v76.61,44.91 v78.23,44.91 v93.07,44.91 | 89.81,31.5 92.05,33.73 v93.07,33.73
MX_LATCH  (via drill 0.3)
  Top 0.203: v70.31,32.31 70.31,48.56 68.28,48.56 67.26,47.55 67.26,43.28 SV6.A3 | v83.92,32.31 83.92,34.95 IC1.12 83.92,35.15 83.92,39.22 84.73,40.03 84.73,46.13 83.92,46.94 JP9.7 | JP8.7 85.95,30.89 v85.95,32.11
  Bottom 0.203: v70.31,32.31 70.71,31.9 76.2,31.9 77.01,32.72 82.7,32.72 83.11,32.31 v83.92,32.31 85.75,32.31 v85.95,32.11
MX_VCC  (via drill 0.3)
  Top 0.203: IC1.16 94.08,34.95 94.08,30.48 JP8.1 | v68.89,46.13 68.89,39.83 67.26,38.2 SV6.VCC | IC1.10 77.22,36.58 v77.22,37.8 77.22,45.92 76.2,46.94 JP9.1
  Bottom 0.203: v68.89,46.13 69.7,46.94 76.2,46.94 JP9.1 | IC1.16 91.44,37.59 83.92,37.59 83.52,38 83.11,38 82.7,37.59 77.42,37.59 v77.22,37.8
N$1  (via drill 0.3)
  Top 0.203: v16.87,7.32 16.87,13.41 15.85,13.41 U2.20
  Bottom 0.203: v16.87,7.32 15.65,6.1 C7.1
N$2  (via drill 0.3)
  Top 0.203: v12.19,13.01 v12.19,14.63 | v8.74,11.99 7.32,11.99 U2.7
  Bottom 0.203: 10.97,15.04 C6.2 10.97,14.83 11.18,14.63 v12.19,14.63 | v12.19,13.01 11.38,12.19 10.36,12.19 Q1.2 10.16,11.99 v8.74,11.99
N$3  (via drill 0.3)
  Top 0.203: v29.26,20.32 29.26,22.15 28.25,22.15 U5.1
  Bottom 0.203: v29.26,20.32 34.54,15.04 34.54,6.5 34.34,6.5 J3.1
N$4  (via drill 0.3)
  Top 0.203: v7.32,10.36 7.32,10.97 U2.8
  Bottom 0.203: 10.97,4.47 C5.2 10.77,4.47 10.77,7.72 10.36,7.72 Q1.1 10.16,7.92 9.75,7.92 v7.32,10.36
N$5
  Top 0.203: U5.4 28.25,18.29 29.06,17.48 29.06,6.5 J3.2
N$6  (via drill 0.3)
  Top 0.203: v85.95,71.93 86.97,70.92 SV5.1
  Bottom 0.203: v85.95,71.93 85.75,72.14 83.92,72.14 82.91,73.15 U$1.A4
N$7
  Top 0.203: SV5.3 86.97,69.9 85.34,69.9 85.34,73.15 U$1.A5
N$8
  Bottom 0.203: K3.4 15.65,63.6 8.74,63.6 5.08,67.26 R9.2
N$9
  Bottom 0.203: R8.2 5.08,63.4 6.1,62.38 7.92,62.38 K2.4
N$10
  Bottom 0.203: LED3.A 3.45,71.12 3.45,59.33 2.85,58.73 2.64,58.73 2.64,55.88 R6.1
N$11
  Top 0.203: R7.1 2.44,59.74 1.63,60.55 1.63,75.39 2.44,76.2 LED4.A
N$12
  Top 0.203: D1.4 41.25,57.3 39.42,59.13 39.42,62.18 R1.1
N$13
  Bottom 0.203: D1.3 42.67,57.3 42.67,62.18 43.08,62.18 R3.1
N$14
  Top 0.203: D1.1 45.11,57.3 46.94,59.13 46.94,62.18 R14.1
N$15
  Top 0.203: R14.2 47.14,64.82 48.16,65.84 48.16,69.7 JP2.17
N$16  (via drill 0.3)
  Top 0.203: R10.1 48.16,36.58 45.72,39.01 45.72,41.25 45.11,41.86 SV3.D0_RX | v42.47,43.69 41.25,44.91 SW1.A
  Bottom 0.203: v42.47,43.69 45.11,43.69 45.72,43.08 45.72,42.06 45.11,42.06 SV3.D0_RX
N$17  (via drill 0.3)
  Top 0.203: v46.33,41.45 48.16,41.45 R11.1 | v45.72,33.12 41.25,28.65 SW2.A
  Bottom 0.203: v46.33,41.45 45.92,41.05 45.72,41.05 | 45.72,41.05 45.11,41.05 SV3.D1_TX | v45.72,33.12 45.72,41.05
N$18
  Top 0.203: 43.28,48.97 47.75,48.97 SW1.B' | 43.28,48.97 41.25,48.97 SW1.B | 46.33,34.54 47.75,33.12 47.75,32.51 SW2.B' | 46.33,34.54 45.11,35.76 SV3.GND | 43.28,32.51 44.5,32.51 44.5,32.72 46.33,34.54 | 43.28,32.51 41.25,32.51 SW2.B | 43.28,32.51 43.28,48.97
N$19
  Top 0.203: 45.72,5.89 42.06,5.89 R13.2 41.86,6.1 41.86,18.09 R12.2 | 45.72,5.89 45.72,5.08 JP1.1 | 45.72,5.89 45.72,10.57 45.11,11.18 SV4.VCC
N$20
  Bottom 0.203: SV4.GND 45.11,9.14 45.31,8.94 46.94,8.94 JP1.3
N$21
  Top 0.203: 43.28,16.87 43.28,15.85 43.89,15.24 SV4.A5_SCL | 43.28,16.87 43.28,18.49 42.06,19.71 R12.1 | 43.28,16.87 45.31,16.87 45.72,16.46 45.72,12.8 46.94,11.58 JP1.4
N$22
  Top 0.203: JP1.5 48.16,12.8 48.16,2.64 44.7,2.64 43.28,4.06 42.06,4.06 R13.1
  Bottom 0.203: SV4.A4_SDA 44.09,16.26 44.09,16.87 45.31,16.87 45.72,16.46 45.72,14.02 46.94,14.02 JP1.5
N$23
  Bottom 0.203: D2.4 96.52,53.85 96.32,53.65 88.59,53.65 85.14,57.1 82.7,57.1 R4.2
N$24
  Top 0.203: R4.1 77.42,59.74 77.42,74.98 U$1.17
N$25
  Bottom 0.203: D2.3 96.52,55.27 96.11,55.68 87.78,55.68 86.36,57.1 R5.2
N$26
  Bottom 0.203: R3.2 43.08,64.82 39.22,68.68 31.5,68.68 30.48,69.7 JP2.3
N$27
  Bottom 0.203: R1.2 39.22,64.82 35.76,68.28 29.46,68.28 28.04,69.7 JP2.1
N$28
  Bottom 0.203: SV7.A4_SDA 56.49,16.26 56.49,22.55 53.85,22.55 JP10.1
N$29  (via drill 0.3)
  Top 0.203: v82.91,67.67 86.97,67.67 SV5.7
  Bottom 0.203: v82.91,67.67 79.86,64.62 68.68,64.62 66.04,61.98 U$1.12
N$30  (via drill 0.3)
  Top 0.203: v82.91,66.65 86.97,66.65 SV5.9
  Bottom 0.203: v82.91,66.65 80.47,64.21 71.93,64.21 68.68,60.96 U$1.11
N$31  (via drill 0.3)
  Top 0.203: v82.91,65.63 86.97,65.63 SV5.11
  Bottom 0.203: v82.91,65.63 81.08,63.8 73.97,63.8 U$1.10
N$32  (via drill 0.3)
  Top 0.203: v83.31,64.62 86.97,64.62 SV5.13
  Bottom 0.203: v83.31,64.62 82.09,63.4 76.2,63.4 73.76,60.96 U$1.9
N$33  (via drill 0.3)
  Top 0.203: v84.12,63.8 86.97,63.8 SV5.15
  Bottom 0.203: v84.12,63.8 83.31,62.99 78.23,62.99 U$1.8
N$34  (via drill 0.3)
  Top 0.203: v89.2,66.24 89.2,66.65 90.63,66.65 SV5.10
  Bottom 0.203: v89.2,66.24 85.55,62.59 80.47,62.59 78.84,60.96 U$1.7
N$35  (via drill 0.3)
  Top 0.203: v89.41,67.26 89.41,67.67 90.63,67.67 SV5.8
  Bottom 0.203: v89.41,67.26 89.41,66.85 89.81,66.45 89.81,62.18 82.5,62.18 U$1.6
N$36
  Top 0.203: U$1.13 66.04,77.42 81.89,77.42 82.5,76.81 82.5,75.79 83.92,74.37 83.92,68.89 86.97,68.89 SV5.5
N$37  (via drill 0.3)
  Top 0.203: v91.64,71.53 91.85,71.32 91.85,68.89 90.83,68.89 SV5.6
  Bottom 0.203: v91.64,71.53 91.64,66.65 93.88,64.41 93.88,60.96 U$1.1
N$38  (via drill 0.3)
  Top 0.203: v89.41,68.28 89.41,69.7 90.63,69.7 SV5.4
  Bottom 0.203: v89.41,68.28 91.44,66.24 U$1.2
N$39
  Top 0.203: R5.1 86.36,54.66 83.92,57.1 83.92,58.12 82.5,59.54 82.5,64.01 80.67,65.84 80.67,74.37 78.84,76.2 U$1.18
N$40
  Bottom 0.203: D2.1 96.52,57.71 96.11,57.3 90.22,57.3 R15.2
N$41
  Bottom 0.203: SV7.A5_SCL 56.49,15.24 55.68,16.05 55.68,20.12 53.85,20.12 JP10.2
N$42  (via drill 0.3)
  Top 0.203: v15.04,22.35 R20.1 | v9.75,21.34 8.94,22.15 8.94,23.16 8.53,23.57 5.28,23.57 v5.28,22.96
  Bottom 0.203: v15.04,22.35 14.02,21.34 v9.75,21.34 | v5.28,22.96 1.83,22.96 D3.1
N$43
  Top 0.203: SV7.D10~ 56.49,14.22 55.68,15.04 55.68,15.65 53.85,17.48 JP10.3
N$44
  Bottom 0.203: SV7.D9~ 56.49,13.21 54.66,15.04 53.85,15.04 JP10.4
N$45
  Top 0.203: SV7.D8 56.49,12.39 53.85,12.39 JP10.5
N$46
  Bottom 0.203: SV7.D7 56.49,11.18 55.47,10.16 53.85,10.16 JP10.6
N$48
  Top 0.203: SV7.D6~ 56.49,10.16 53.85,7.52 JP10.7
N$50
  Top 0.203: U$1.19 81.28,72.95 82.3,71.93 82.3,64.82 85.14,61.98 85.14,60.35 87.38,58.12 87.38,57.3 90.02,54.66 R15.1
N$51
  Bottom 0.203: R-LED1.2 86.36,1.42 87.17,2.23 95.71,2.23 96.52,1.42 LED1.K
N$53
  Bottom 0.203: SV7.D5~ 56.49,9.14 56.49,5.08 53.85,5.08 JP10.8
N$54
  Bottom 0.203: SV7.A3 57.71,16.26 57.71,22.55 60.35,22.55 JP11.1
N$55
  Top 0.203: SV7.D0_RX 57.71,15.24 58.52,16.05 58.52,18.29 60.35,20.12 JP11.2
N$56
  Top 0.203: SV7.D1_TX 57.71,14.22 58.52,15.04 58.52,15.44 60.35,17.27 60.35,17.48 JP11.3
N$57
  Bottom 0.203: SV7.D3~ 57.71,13.21 59.54,15.04 60.35,15.04 JP11.4
N$58
  Top 0.203: SV7.D4 57.71,12.39 60.35,12.39 JP11.5
N$59
  Bottom 0.203: SV7.VCC 57.71,11.18 58.73,10.16 60.35,10.16 JP11.6
N$60
  Bottom 0.203: SV7.VSS 57.71,10.16 57.91,9.96 58.12,9.96 60.55,7.52 JP11.7
N$61
  Bottom 0.203: SV7.GND 57.71,9.14 57.71,5.08 60.35,5.08 JP11.8
N$62
  Top 0.203: LED9.A 53.24,47.35 52.43,46.53 52.43,38.2 53.24,37.39 R16.1
N$63  (via drill 0.3)
  Top 0.203: v58.52,37.59 58.52,47.35 LED10.A | R17.1 v60.96,35.15
  Bottom 0.203: v60.96,35.15 v58.52,37.59
N$64
  Top 0.203: LED11.A 55.88,47.35 54.86,46.33 54.86,35.97 53.44,34.54 53.44,32.72 R18.1
N$65
  Top 0.203: R19.1 LED12.A
N$66  (via drill 0.3)
  Top 0.203: R21.1 12.8,22.35 v12.8,22.76 | v8.33,22.96 5.89,22.96 5.89,22.15 v5.08,21.34
  Bottom 0.203: v12.8,22.76 12.6,22.96 v8.33,22.96 | v5.08,21.34 4.27,20.52 1.83,20.52 D3.3
N$67  (via drill 0.3)
  Top 0.203: v10.16,23.57 11.38,22.35 R22.1 | v4.67,23.57 3.05,21.95 3.05,20.12 2.23,19.3 1.83,19.3 D3.4
  Bottom 0.203: v10.16,23.57 9.96,23.77 4.88,23.77 v4.67,23.57
N$68
  Top 0.203: 55.88,48.97 53.44,48.97 LED9.C | 59.13,48.97 60.96,48.97 LED12.C | 59.13,48.97 58.52,48.97 LED10.C 58.32,48.97 55.88,48.97 | 59.13,48.97 59.13,37.39 57.71,35.97 SV8.GND | 55.88,48.97 LED11.C
N$69  (via drill 0.3)
  Top 0.203: v66.45,29.87 65.02,31.29 65.02,38 66.04,39.01 SV6.D8
  Bottom 0.203: v66.45,29.87 66.45,28.04 R23.1
N$70  (via drill 0.3)
  Top 0.203: v67.06,31.7 65.43,33.33 65.43,37.39 66.04,38 SV6.D7
  Bottom 0.203: v67.06,31.7 66.65,31.7 66.04,31.09 R24.1
N$71  (via drill 0.3)
  Top 0.203: v68.48,47.95 69.49,46.94 v69.49,36.37
  Bottom 0.203: v68.48,47.95 67.67,47.95 65.84,49.78 R25.1 | v69.49,36.37 68.48,35.36 65.84,35.36 65.43,35.76 65.43,36.98 66.04,36.98 SV6.D6~
N$72  (via drill 0.3)
  Top 0.203: v68.28,33.73 66.24,35.76 66.24,35.97 SV6.D5~
  Bottom 0.203: v68.28,33.73 69.49,33.73 69.7,33.53 R26.1
N$73  (via drill 0.3)
  Top 0.203: v67.87,44.5 67.87,42.88 67.26,42.27 SV6.D0_RX
  Bottom 0.203: v67.87,44.5 67.26,44.5 66.24,45.52 R27.2
N$74  (via drill 0.3)
  Top 0.203: v68.28,45.52 68.48,45.31 68.48,42.47 67.26,41.25 SV6.D1_TX
  Bottom 0.203: v68.28,45.52 69.49,45.52 69.7,45.31 R28.2
N$75
  Bottom 0.203: R29.2 77.83,39.42 67.87,39.42 67.26,40.03 SV6.D3~
N$76
  Bottom 0.203: R30.2 69.7,38.61 69.29,39.01 67.26,39.01 SV6.D4
PIN3  (via drill 0.3)
  Top 0.203: v8.13,2.64 5.28,5.49 5.28,16.66 7.11,16.66 U2.1 | v11.99,0.81 13.01,1.83 13.01,2.64 J1.8
  Bottom 0.203: v8.13,2.64 9.96,0.81 v11.99,0.81
PIN4  (via drill 0.3)
  Top 0.203: v8.13,3.45 5.69,5.89 5.69,15.85 7.11,15.85 U2.2 | v11.38,1.42 12.19,2.23 12.19,2.64 J1.10
  Bottom 0.203: v8.13,3.45 10.16,1.42 v11.38,1.42
PIN5
  Top 0.203: U2.9 8.74,9.55 8.74,6.71 9.14,6.3 J1.15
PIN6
  Top 0.203: U2.10 9.55,9.55 9.55,7.32 10.16,6.71 10.16,6.3 J1.13
PIN7
  Top 0.203: U2.11 10.36,9.55 10.36,7.52 11.18,6.71 11.18,6.3 J1.11
PIN8
  Top 0.203: U2.12 11.18,9.55 11.18,7.72 12.19,6.71 12.19,6.3 J1.9
PIN9
  Top 0.203: U2.13 11.99,9.55 11.99,7.92 13.01,6.91 13.01,6.3 J1.7
PIN10
  Top 0.203: U2.14 12.8,9.55 12.8,8.13 14.02,6.91 14.02,6.3 J1.5
PWM1
  Bottom 0.203: SV1.D5~ 31.29,35.76 31.29,32.51 33.73,32.51 35.36,30.89 35.36,28.04 34.34,28.04 SERVOS.5
PWM2
  Bottom 0.203: SV1.D6~ 31.09,36.78 30.48,36.17 30.48,32.11 32.72,32.11 34.34,30.48 SERVOS.6
RESET  (via drill 0.3)
  Top 0.203: v10.97,19.51 10.97,18.29 U2.29
  Bottom 0.203: RST.1 19.51,21.54 18.9,20.93 10.97,20.93 10.77,20.73 R2.1 10.77,20.52 10.97,20.52 v10.97,19.51
ROW1  (via drill 0.3)
  Top 0.203: JP8.2 92.46,29.46 92.46,37.19 90.02,39.62 90.02,47.75 v89.61,48.16 | v77.22,48.16 76.2,49.17 JP9.2
  Bottom 0.203: R27.1 66.24,47.35 72.14,47.35 72.95,48.16 LED8.9 73.15,48.36 73.56,48.77 75.59,48.77 76.2,49.38 JP9.2 | v89.61,48.16 83.52,48.16 82.3,46.94 82.3,45.92 78.23,45.92 77.22,46.94 v77.22,48.16
ROW2  (via drill 0.3)
  Top 0.203: v91.85,32.72 90.42,34.14 90.42,37.8 v88.39,39.83 | v80.67,39.42 80.06,38.81 v80.06,32.11 | v77.22,32.11 74.37,32.11 74.37,34.34 73.15,35.56 LED8.14 72.95,35.56 71.93,36.58 71.93,41.45 v70.92,42.47 70.92,44.3 73.36,44.3 75.18,46.13 75.18,47.75 v75.59,48.16
  Bottom 0.203: v70.92,42.47 69.9,43.48 R28.1 | v91.85,32.72 92.66,31.9 98.35,31.9 98.35,30.07 97.13,28.85 94.69,28.85 94.49,29.06 92.46,29.06 91.44,28.04 JP8.4 | v88.39,39.83 81.08,39.83 v80.67,39.42 | v77.22,32.11 v80.06,32.11 | v75.59,48.16 76.4,48.16 77.01,48.77 78.03,48.77 78.64,49.38 JP9.4
ROW3  (via drill 0.3)
  Top 0.203: v79.65,40.44 79.86,40.64 79.86,47.95 81.28,49.38 JP9.6 | JP8.6 89.81,28.85 89.81,29.87 90.02,30.07 90.02,36.58 v88.39,38.2 | v96.11,39.62 95.91,39.83 95.91,47.14 96.93,48.16 LED8.8
  Bottom 0.203: v79.65,40.44 79.65,39.42 R29.1 79.65,39.22 80.06,38.81 82.7,38.81 82.91,38.61 87.99,38.61 88.19,38.41 | v96.11,39.62 94.89,38.41 88.19,38.41 | 88.19,38.41 v88.39,38.2
ROW4  (via drill 0.3)
  Top 0.203: v78.03,48.16 77.62,47.75 77.62,40.64 v77.83,40.44 | v87.99,46.13 87.78,45.92 87.78,29.46 86.36,28.04 JP8.8 | v85.14,46.74 84.94,46.94 84.94,48.36 83.92,49.38 JP9.8
  Bottom 0.203: R30.1 69.9,40.23 70.31,40.64 LED8.12 77.62,40.64 v77.83,40.44 | v78.03,48.16 82.5,48.16 83.72,49.38 JP9.8 | v87.99,46.13 87.78,45.92 85.95,45.92 v85.14,46.74
ROW5  (via drill 0.3)
  Top 0.203: v70.92,34.95 71.93,33.93 71.93,30.07 72.75,29.26 74.37,29.26 v74.37,29.46 | JP8.10 85.34,29.46 85.34,32.72 85.95,32.72 87.38,34.14 87.38,48.36 86.36,49.38 JP9.10 | v90.63,31.5 90.42,31.29 v90.42,28.85
  Bottom 0.203: v70.92,34.95 69.9,34.95 R26.2 | v74.37,29.46 82.3,29.46 82.7,29.06 | JP8.10 82.7,29.06 | v90.63,31.5 95.91,31.5 96.93,30.48 LED8.1 | v90.42,28.85 90.22,29.06 82.7,29.06
ROW6  (via drill 0.3)
  Top 0.203: v84.73,39.22 84.73,36.17 84.94,35.97 84.94,30.07 84.73,29.87 84.73,29.46 83.72,29.46 82.7,28.45 82.7,28.04 81.28,28.04 JP8.12 | v90.63,39.83 90.42,40.03 90.42,48.16 89,49.58 JP9.12 | v73.36,49.58 74.57,48.36 v74.57,46.33
  Bottom 0.203: v84.73,39.22 90.02,39.22 v90.63,39.83 | v73.36,49.58 67.67,49.58 67.46,49.78 R25.2 | v74.57,46.33 75.39,45.52 90.22,45.52 | 90.22,45.52 96.72,45.52 96.93,45.72 LED8.7 | 90.22,45.52 90.22,48.36 89.81,48.77 89.61,48.77 89,49.38 JP9.12
ROW7  (via drill 0.3)
  Top 0.203: v73.36,28.65 74.37,27.64 75.18,27.64 75.18,28.45 75.79,29.06 78.64,29.06 | 78.64,29.06 78.64,28.04 JP8.14 | 95.5,40.44 95.5,34.54 96.93,33.12 LED8.2 | 95.5,40.44 95.5,43.89 92.86,46.53 92.86,47.95 91.44,49.38 JP9.14 | 78.64,29.06 81.48,29.06 82.3,29.87 82.3,37.59 81.89,38 v81.89,40.44 | 95.5,40.44 v95.3,40.44
  Bottom 0.203: v73.36,28.65 73.15,28.65 69.49,32.31 66.24,32.31 66.04,32.51 R24.2 | v95.3,40.44 v81.89,40.44
ROW8  (via drill 0.3)
  Top 0.203: 98.35,41.86 98.35,49.38 94.08,49.38 JP9.16 | 98.35,41.86 97.13,40.64 LED8.5 | v74.57,28.25 74.78,28.45 74.78,29.06 74.98,29.26 v74.98,30.89 | v94.89,29.46 95.91,30.48 95.91,30.89 96.93,31.9 98.35,31.9 98.35,41.86
  Bottom 0.203: 74.57,28.04 76.2,28.04 JP8.16 | 74.57,28.04 68.28,28.04 R23.2 | v74.57,28.25 74.57,28.04 | v74.98,30.89 75.59,31.5 81.89,31.5 82.7,30.68 82.7,29.67 83.11,29.67 83.31,29.46 v94.89,29.46
RXI  (via drill 0.3)
  Top 0.203: v10.36,17.07 10.36,18.09 U2.30 | v20.32,17.68 20.73,17.27 20.73,5.69 16.66,1.63 15.24,1.63 15.24,2.64 J1.4
  Bottom 0.203: v10.36,17.07 10.77,17.48 19.1,17.48 19.3,17.68 v20.32,17.68
SCK  (via drill 0.3)
  Top 0.203: v16.05,10.36 16.05,10.77 15.85,10.97 U2.17
  Bottom 0.203: v16.05,10.36 22.76,10.36 23.37,10.97 23.37,16.46 22.35,16.46 ANNAREF.5
SCL  (via drill 0.3)
  Top 0.203: v11.58,10.77 11.58,17.88 11.79,18.09 U2.28 | v15.04,8.94 15.04,6.3 J1.3
  Bottom 0.203: v11.58,10.77 13.41,8.94 v15.04,8.94
SDA  (via drill 0.3)
  Top 0.203: v12.8,12.39 12.8,18.09 U2.27 | v18.29,10.97 18.29,4.67 17.88,4.27 16.26,4.27 16.26,6.1 J1.1
  Bottom 0.203: v12.8,12.39 14.22,10.97 v18.29,10.97
SM_5V
  Top 0.203: 31.7,30.48 31.7,28.04 SERVOS.3 | 30.48,44.09 27.03,44.09 27.03,45.11 U6.3 | 30.48,44.09 32.11,44.09 32.92,43.28 32.92,41.25 34.54,39.62 C10.1 | 31.7,30.48 30.48,31.7 30.48,44.09 | 31.7,30.48 SERVOS.4
SM_GND  (via drill 0.3)
  Top 0.203: SERVOS.1 29.26,28.04 29.26,30.48 SERVOS.2 | 35.76,37.39 34.75,36.37 C9.2 | 35.76,37.39 35.76,40.23 34.75,41.25 C10.2 34.54,41.45 34.54,46.94 34.14,47.35 U6.4 | 33.93,33.53 33.53,33.93 33.53,34.54 32.31,35.76 SV1.GND | 33.93,33.53 35.76,33.53 35.76,37.39 | v32.51,31.5 33.93,32.92 33.93,33.53
  Bottom 0.203: v32.51,31.5 30.28,31.5 29.26,30.48 SERVOS.2
SM_VSS  (via drill 0.41)
  Top 0.254: C9.1 33.12,35.97 33.12,36.37 32.72,36.78 32.31,36.78 SV1.VSS | v30.48,45.72 30.48,46.33 27.03,49.78 U6.1
  Bottom 0.254: v30.48,45.72 33.12,43.08 33.12,36.98 32.31,36.98 SV1.VSS
TXO
  Top 0.203: U2.31 9.35,18.09 9.35,11.79 7.92,10.36 7.92,5.89 9.14,4.67 14.02,4.67 14.02,2.85 J1.6
VSS
  Top 0.254: J1.14 10.16,2.64 9.75,2.23 9.75,1.63 8.74,0.61 2.64,0.61 2.64,2.44 POWER.1
  Bottom 0.254: 2.85,16.26 5.28,18.69 U1.3 | 2.85,16.26 2.23,16.26 2.03,16.05 2.03,9.55 2.85,9.55 C2.1 2.85,9.35 2.85,6.91 C1.1 2.64,6.71 2.64,2.64 POWER.1 | 2.85,16.26 8.53,16.26 10.16,17.88 13.21,17.88 15.44,20.12 20.73,20.12 22.15,21.54 V.1
(copper drawn outside any net)
  shapes: Bottom area x7, Top area x7

## Text on the board
tNames: GND | SCK | 3.3V | MISO | MOSI | CS | IRQ | CE
tDocu: ISP | nRF24L01 | nRF24L01 | Arduino Pro Mini / Generic Smarty | R_Keys | nRF24L01 | nRF24L01 | R_LEDs | - | Servos / uShield | Buttons / uShield | LEDs / uShield | 11 | 10 | 6 | nRF24L01 | DC Motor / uShield | IMU uShield | - | + | - | + | - | Breakout / uShield | + | + | -
bDocu: RoboTal / Generic / Smartie | v1.0